# Altium project ESPGith.PrjPcb
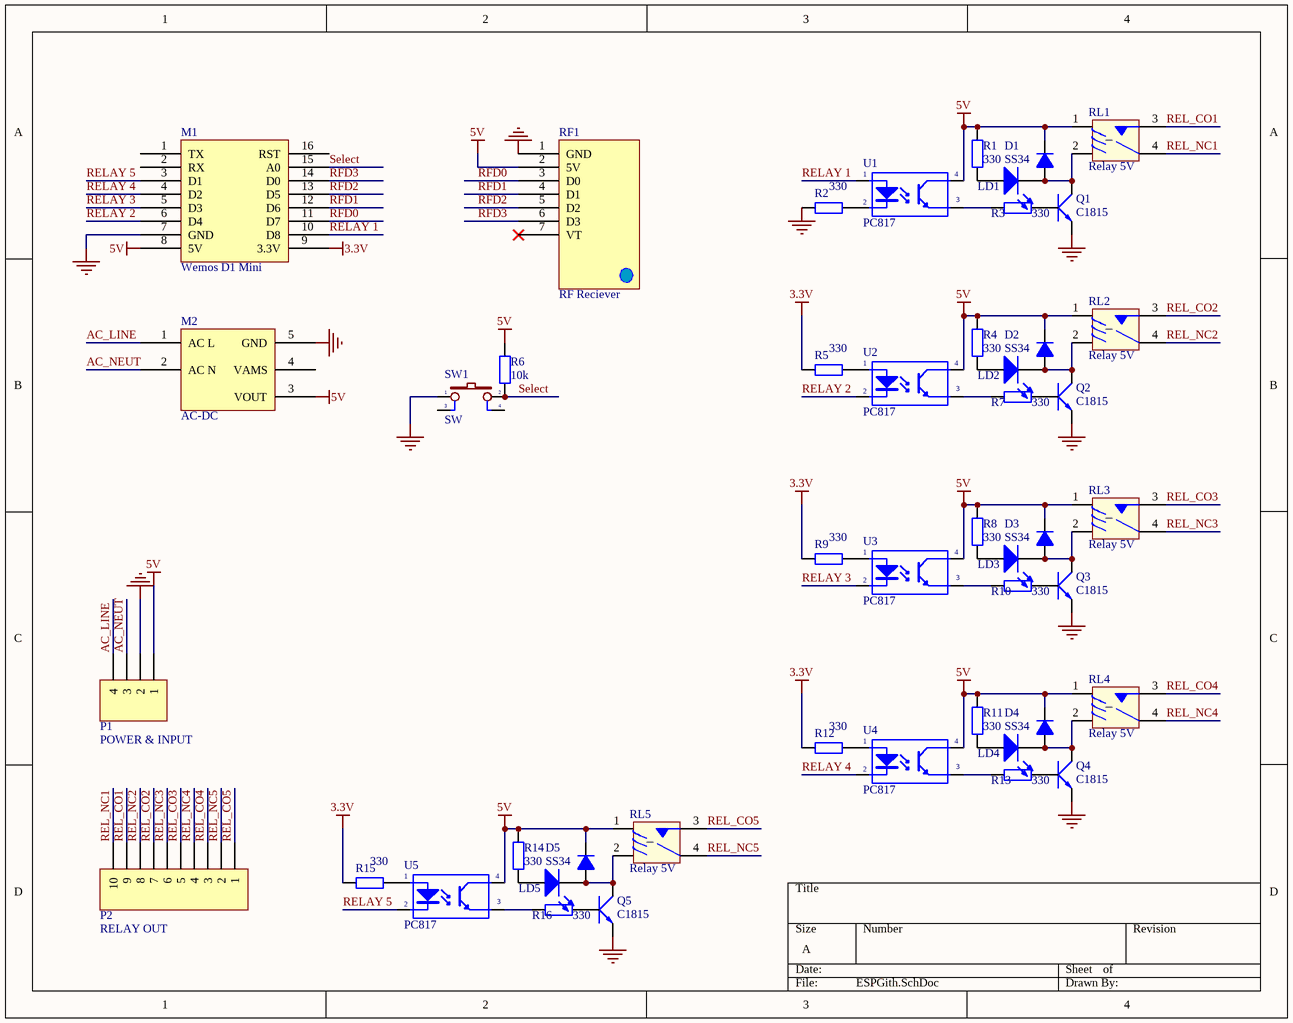
[diagram p0: ESPGith.SchDoc]
1 sheet, 47 parts. Net scope: global (net labels, ports and power ports of the same name join across sheets).
Board file: ESPGith.PcbDoc

## Sheet ESPGith.SchDoc
size A

### Parts
D1  SS34  [DO-214AC]
D2  SS34  [DO-214AC]
D3  SS34  [DO-214AC]
D4  SS34  [DO-214AC]
D5  SS34  [DO-214AC]
LD1  CONNECTION  [LED-3mm Yellow]  (value not drawn)
LD2  CONNECTION  [LED-3mm Yellow]  (value not drawn)
LD3  CONNECTION  [LED-3mm Yellow]  (value not drawn)
LD4  CONNECTION  [LED-3mm Yellow]  (value not drawn)
LD5  CONNECTION  [LED-3mm Yellow]  (value not drawn)
M1  Wemos D1 Mini  [Wemos D1 Mini]
M2  AC-DC  [AC-DC 5V3W]
P1  POWER & INPUT  [TB 4 RA 3.81]
P2  RELAY OUT  [TB 10 RA 3.81]
Q1  C1815  [SOT23-3]
Q2  C1815  [SOT23-3]
Q3  C1815  [SOT23-3]
Q4  C1815  [SOT23-3]
Q5  C1815  [SOT23-3]
R1  value 330  [RESC2012N_F]  (hidden comment: 220)
R2  330  [RESC2012N_F]
R3  330  [RESC2012N_F]
R4  value 330  [RESC2012N_F]  (hidden comment: 220)
R5  330  [RESC2012N_F]
R6  10k  [RESC2012N_F]
R7  330  [RESC2012N_F]
R8  value 330  [RESC2012N_F]  (hidden comment: 220)
R9  330  [RESC2012N_F]
R10  330  [RESC2012N_F]
R11  value 330  [RESC2012N_F]  (hidden comment: 220)
R12  330  [RESC2012N_F]
R13  330  [RESC2012N_F]
R14  value 330  [RESC2012N_F]  (hidden comment: 220)
R15  330  [RESC2012N_F]
R16  330  [RESC2012N_F]
RF1  RF Reciever  [RF Reciever]
RL1  Relay 5V  [RL_HF46F]
RL2  Relay 5V  [RL_HF46F]
RL3  Relay 5V  [RL_HF46F]
RL4  Relay 5V  [RL_HF46F]
RL5  Relay 5V  [RL_HF46F]
SW1  SW  [SW4]
U1  PC817  [DIP4/W0.3]
U2  PC817  [DIP4/W0.3]
U3  PC817  [DIP4/W0.3]
U4  PC817  [DIP4/W0.3]
U5  PC817  [DIP4/W0.3]

### Nets
3.3V: M1.9(3.3V) R5.2 R9.2 R12.2 R15.2
5V: D1.K D2.K D3.K D4.K D5.K M1.8(5V) M2.3(VOUT) P1.1 R1.2 R4.2 R6.2 R8.2 R11.2 R14.2 RF1.2(5V) RL1.1 RL2.1 RL3.1 RL4.1 RL5.1 U1.4(C) U2.4(C) U3.4(C) U4.4(C) U5.4(C)
GND: M1.7(GND) M2.5(GND) P1.2 Q1.2(E) Q2.2(E) Q3.2(E) Q4.2(E) Q5.2(E) R2.2 RF1.1(GND) SW1.1
AC_LINE: M2.1(AC_L) P1.4
AC_NEUT: M2.2(AC_N) P1.3
REL_CO1: P2.9 RL1.3
REL_CO2: P2.7 RL2.3
REL_CO3: P2.5 RL3.3
REL_CO4: P2.3 RL4.3
REL_CO5: P2.1 RL5.3
REL_NC1: P2.10 RL1.4
REL_NC2: P2.8 RL2.4
REL_NC3: P2.6 RL3.4
REL_NC4: P2.4 RL4.4
REL_NC5: P2.2 RL5.4
RELAY 1: M1.10(D8) U1.1(A)
RELAY 2: M1.6(D4) U2.2(K)
RELAY 3: M1.5(D3) U3.2(K)
RELAY 4: M1.4(D2) U4.2(K)
RELAY 5: M1.3(D1) U5.2(K)
RFD0: M1.11(D7) RF1.3(D0)
RFD1: M1.12(D6) RF1.4(D1)
RFD2: M1.13(D5) RF1.5(D2)
RFD3: M1.14(D0) RF1.6(D3)
Select: M1.15(A0) R6.1 SW1.2
NetD1_A: D1.A LD1.2(K) Q1.3(C) RL1.2
NetD2_A: D2.A LD2.2(K) Q2.3(C) RL2.2
NetD3_A: D3.A LD3.2(K) Q3.3(C) RL3.2
NetD4_A: D4.A LD4.2(K) Q4.3(C) RL4.2
NetD5_A: D5.A LD5.2(K) Q5.3(C) RL5.2
NetLD1_1: LD1.1(A) R1.1
NetLD2_1: LD2.1(A) R4.1
NetLD3_1: LD3.1(A) R8.1
NetLD4_1: LD4.1(A) R11.1
NetLD5_1: LD5.1(A) R14.1
NetQ1_1: Q1.1(B) R3.2
NetQ2_1: Q2.1(B) R7.2
NetQ3_1: Q3.1(B) R10.2
NetQ4_1: Q4.1(B) R13.2
NetQ5_1: Q5.1(B) R16.2
NetR2_1: R2.1 U1.2(K)
NetR3_1: R3.1 U1.3(E)
NetR5_1: R5.1 U2.1(A)
NetR7_1: R7.1 U2.3(E)
NetR9_1: R9.1 U3.1(A)
NetR10_1: R10.1 U3.3(E)
NetR12_1: R12.1 U4.1(A)
NetR13_1: R13.1 U4.3(E)
NetR15_1: R15.1 U5.1(A)
NetR16_1: R16.1 U5.3(E)

Not connected (* = marked no-connect by the designer): M1 1(TX) 2(RX) 16(RST); M2 4(VAMS); RF1 7(VT)*; SW1 3 4

### Library data of the parts
D1-D5 = D1A: Diode 1A; Value: 1N4007
LD1-LD5 = LED2: Typical RED, GREEN, YELLOW, AMBER GaAs LED; Published: 8-Jun-2000; LatestRevisionDate: 17-Jul-2002; LatestRevisionNote: Re-released for DXP Platform.; PackageVersion: Feb-2002; PackageReference: 3.2X1.6X1.1; Publisher: Altium Limited; PackageDescription: SM LED; 2 Flat Leads
M2 = AC-DC 5V3W: AC -> DC 5V 3W
P1 = Header 4: Header, 4-Pin; LatestRevisionDate: 17-Jul-2002; LatestRevisionNote: Re-released for DXP Platform.; Publisher: Altium Limited
P2 = Header 10: Header, 10-Pin; LatestRevisionDate: 17-Jul-2002; LatestRevisionNote: Re-released for DXP Platform.; Publisher: Altium Limited
Q1-Q5 = C1815: NPN 600mW, ECB; Value: C1815
R1 R4 R8 R11 R14 = Res 1/4 W: Resistor; Published: 8-Jun-2000; LatestRevisionDate: 17-Jul-2002; LatestRevisionNote: Re-released for DXP Platform.; PackageReference: AXIAL-0.4; Publisher: Altium Limited
R2 R3 R5 R7 R9 R10 R12 R13 R15 R16 = R1/4W: Resistor 1/4W; Value: R1/4W - 1K
R6 = R0805: Resistor SMD 0805; Value: 470; Published: 8-Jun-2000; LatestRevisionDate: 17-Jul-2002; LatestRevisionNote: Re-released for DXP Platform.; PackageReference: AXIAL-0.4; Publisher: Altium Limited
RL1-RL5 = Relay 3: Relay SPDT,10A - 12VDC 5 Pin; Value: Relay SPDT, 10A, 12V
SW1 = SW4-1: Switch button 4 pin; Value: SW chip 4 pin
U1-U5 = PC817: Single Opto; Value: PC817